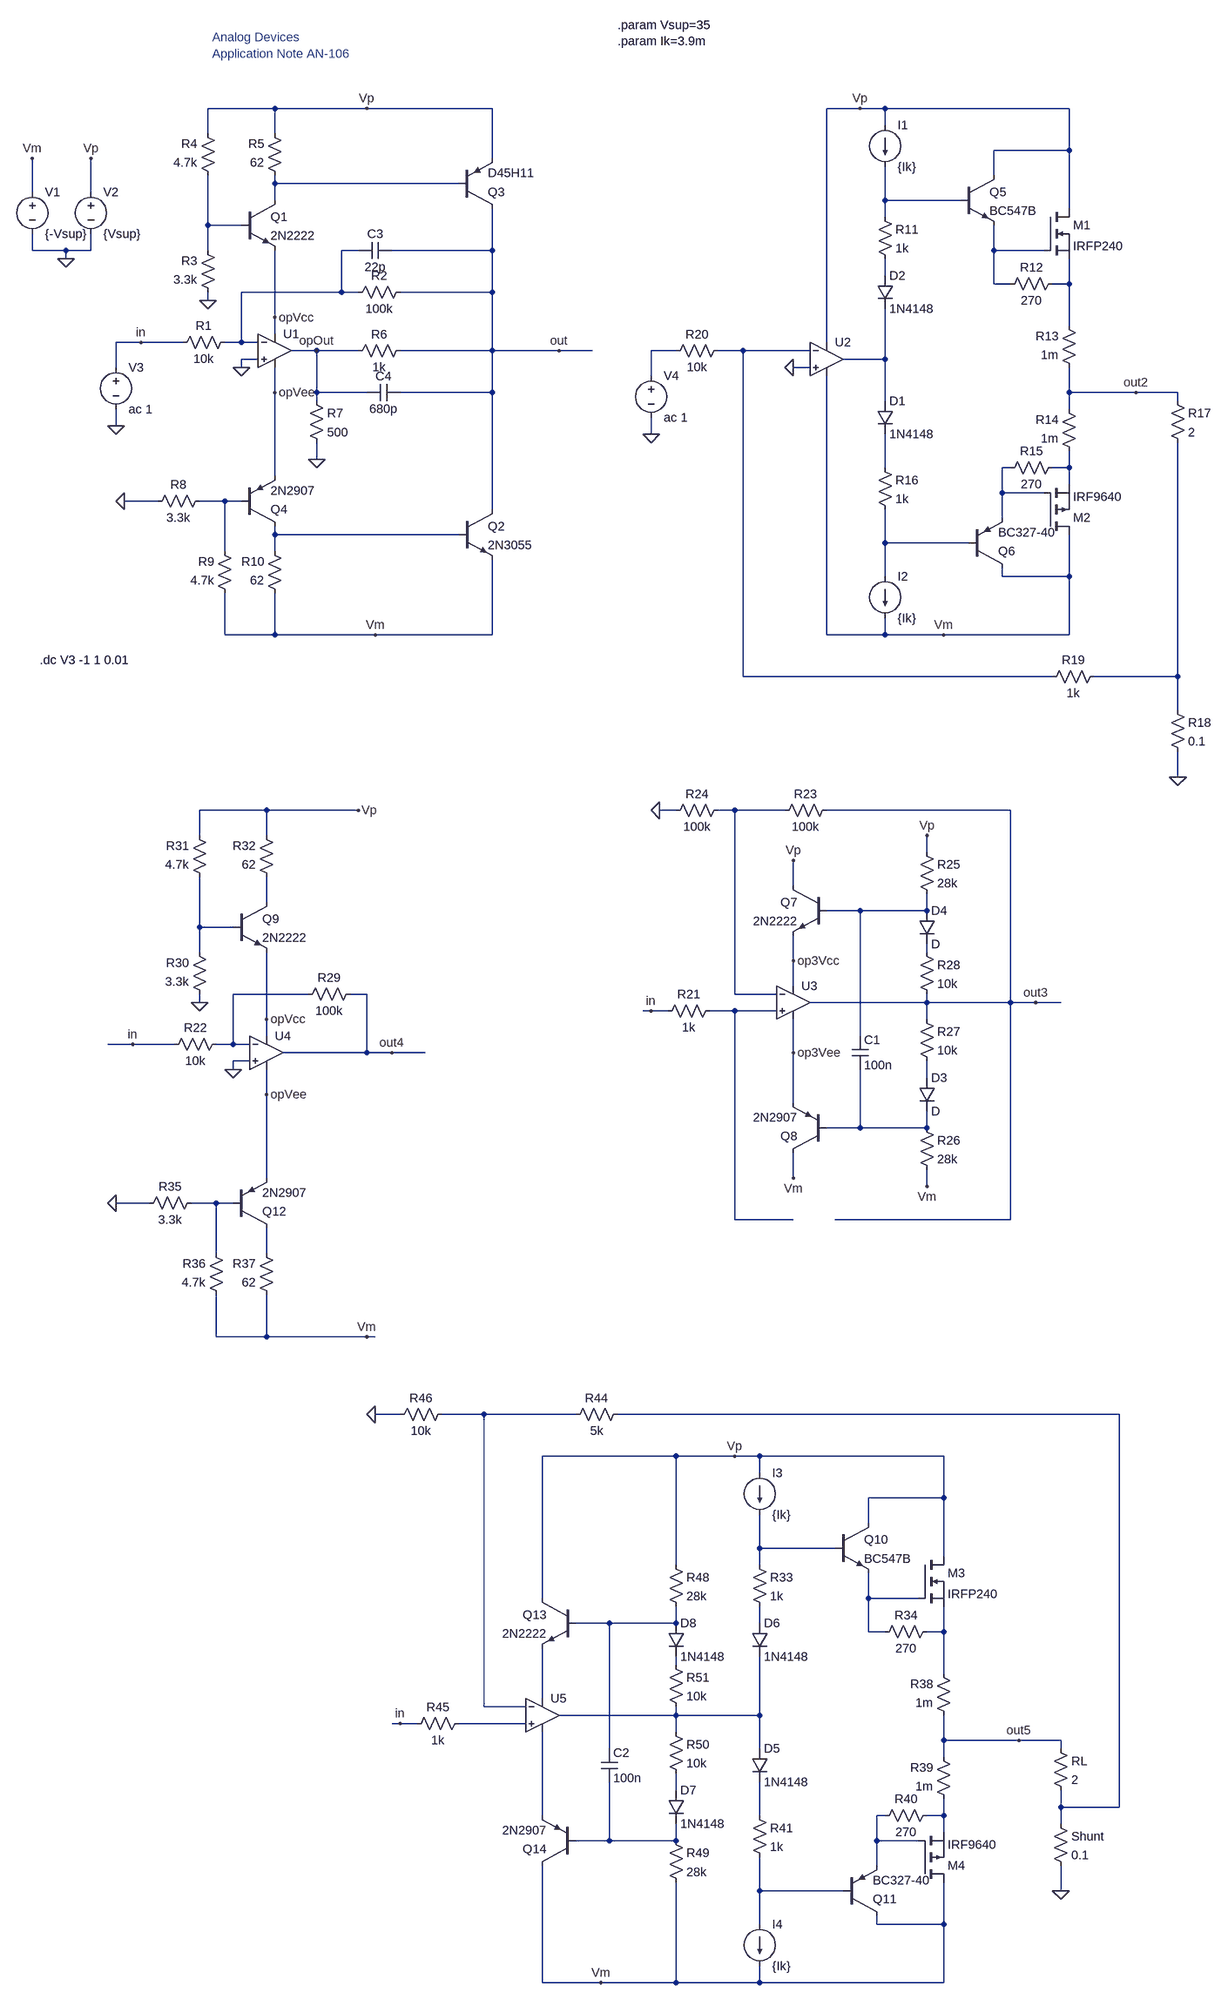
[diagram p0: schematic OpAmp_bootstrap_biased.asc]
OpAmp_bootstrap_biased.asc, the LTspice schematic file:
Version 4
SHEET 1 2744 3924
WIRE 128 -64 0 -64
WIRE 304 -64 128 -64
WIRE 544 -64 304 -64
WIRE 1248 -64 1184 -64
WIRE 1296 -64 1248 -64
WIRE 1648 -64 1296 -64
WIRE 1296 -32 1296 -64
WIRE 0 -16 0 -64
WIRE 128 -16 128 -64
WIRE 1648 16 1648 -64
WIRE 1648 16 1504 16
WIRE 544 32 544 -64
WIRE 1504 64 1504 16
WIRE 128 80 128 64
WIRE 480 80 128 80
WIRE -336 96 -336 32
WIRE -224 96 -224 32
WIRE 128 112 128 80
WIRE 1296 112 1296 48
WIRE 1440 112 1296 112
WIRE 1648 128 1648 16
WIRE 1296 144 1296 112
WIRE 0 160 0 64
WIRE 64 160 0 160
WIRE -336 208 -336 176
WIRE -272 208 -336 208
WIRE -224 208 -224 176
WIRE -224 208 -272 208
WIRE 0 208 0 160
WIRE 288 208 256 208
WIRE 544 208 544 128
WIRE 544 208 352 208
WIRE 1504 208 1504 160
WIRE 1600 208 1504 208
WIRE -272 224 -272 208
WIRE 1296 256 1296 224
WIRE 1504 272 1504 208
WIRE 1536 272 1504 272
WIRE 1648 272 1648 224
WIRE 1648 272 1616 272
WIRE 256 288 256 208
WIRE 256 288 64 288
WIRE 288 288 256 288
WIRE 544 288 544 208
WIRE 544 288 368 288
WIRE 0 304 0 288
WIRE 128 336 128 208
WIRE 1648 352 1648 272
WIRE 128 368 128 336
WIRE -128 384 -176 384
WIRE -48 384 -128 384
WIRE 64 384 64 288
WIRE 64 384 32 384
WIRE 96 384 64 384
WIRE 1184 384 1184 -64
WIRE 208 400 160 400
WIRE 288 400 208 400
WIRE 544 400 544 288
WIRE 544 400 368 400
WIRE 672 400 544 400
WIRE 736 400 672 400
WIRE 896 400 848 400
WIRE 1024 400 976 400
WIRE 1152 400 1024 400
WIRE 96 416 64 416
WIRE 1296 416 1296 320
WIRE 1296 416 1216 416
WIRE -176 432 -176 384
WIRE 64 432 64 416
WIRE 1152 432 1120 432
WIRE 848 448 848 400
WIRE 128 480 128 432
WIRE 208 480 208 400
WIRE 304 480 208 480
WIRE 544 480 544 400
WIRE 544 480 368 480
WIRE 1648 480 1648 432
WIRE 1776 480 1648 480
WIRE 1856 480 1776 480
WIRE 208 496 208 480
WIRE 1296 496 1296 416
WIRE 1856 496 1856 480
WIRE 1648 512 1648 480
WIRE -176 544 -176 512
WIRE 848 560 848 528
WIRE 208 608 208 576
WIRE 1296 624 1296 560
WIRE 1536 624 1520 624
WIRE 1648 624 1648 592
WIRE 1648 624 1616 624
WIRE 128 640 128 480
WIRE 1648 656 1648 624
WIRE 1520 672 1520 624
WIRE 1600 672 1520 672
WIRE -96 688 -160 688
WIRE 32 688 -16 688
WIRE 64 688 32 688
WIRE 544 704 544 480
WIRE 1520 720 1520 672
WIRE 128 752 128 736
WIRE 480 752 128 752
WIRE 1296 768 1296 704
WIRE 1456 768 1296 768
WIRE 32 784 32 688
WIRE 128 784 128 752
WIRE 1296 832 1296 768
WIRE 1520 832 1520 816
WIRE 1648 832 1648 752
WIRE 1648 832 1520 832
WIRE 32 944 32 864
WIRE 128 944 128 864
WIRE 128 944 32 944
WIRE 320 944 128 944
WIRE 544 944 544 800
WIRE 544 944 320 944
WIRE 1184 944 1184 448
WIRE 1296 944 1296 912
WIRE 1296 944 1184 944
WIRE 1408 944 1296 944
WIRE 1648 944 1648 832
WIRE 1648 944 1408 944
WIRE 1024 1024 1024 400
WIRE 1616 1024 1024 1024
WIRE 1856 1024 1856 576
WIRE 1856 1024 1696 1024
WIRE 1856 1088 1856 1024
WIRE 1856 1216 1856 1168
WIRE 112 1280 -16 1280
WIRE 288 1280 112 1280
WIRE 896 1280 864 1280
WIRE 1008 1280 976 1280
WIRE 1104 1280 1008 1280
WIRE 1536 1280 1184 1280
WIRE -16 1328 -16 1280
WIRE 112 1328 112 1280
WIRE 1376 1360 1376 1328
WIRE 1120 1424 1120 1376
WIRE 112 1456 112 1408
WIRE 1248 1472 1184 1472
WIRE 1376 1472 1376 1440
WIRE 1376 1472 1248 1472
WIRE -16 1504 -16 1408
WIRE 48 1504 -16 1504
WIRE -16 1552 -16 1504
WIRE 1376 1552 1376 1536
WIRE 1120 1568 1120 1520
WIRE 1120 1616 1120 1568
WIRE 192 1632 48 1632
WIRE 304 1632 272 1632
WIRE 1008 1632 1008 1280
WIRE 1088 1632 1008 1632
WIRE -16 1648 -16 1632
WIRE 1376 1648 1376 1632
WIRE 1376 1648 1152 1648
WIRE 1536 1648 1536 1280
WIRE 1536 1648 1376 1648
WIRE 1584 1648 1536 1648
WIRE 1632 1648 1584 1648
WIRE 848 1664 832 1664
WIRE 880 1664 848 1664
WIRE 1008 1664 960 1664
WIRE 1088 1664 1008 1664
WIRE 112 1680 112 1552
WIRE 1376 1680 1376 1648
WIRE 112 1712 112 1680
WIRE 1248 1712 1248 1472
WIRE -144 1728 -192 1728
WIRE -64 1728 -144 1728
WIRE 48 1728 48 1632
WIRE 48 1728 16 1728
WIRE 80 1728 48 1728
WIRE 304 1744 304 1632
WIRE 304 1744 144 1744
WIRE 352 1744 304 1744
WIRE 416 1744 352 1744
WIRE 1120 1744 1120 1680
WIRE 80 1760 48 1760
WIRE 48 1776 48 1760
WIRE 1376 1792 1376 1760
WIRE 112 1824 112 1776
WIRE 1120 1840 1120 1744
WIRE 1248 1888 1248 1776
WIRE 1248 1888 1184 1888
WIRE 1376 1888 1376 1856
WIRE 1376 1888 1248 1888
WIRE 112 1984 112 1824
WIRE 1120 1984 1120 1936
WIRE 1376 2000 1376 1968
WIRE -112 2032 -176 2032
WIRE 16 2032 -32 2032
WIRE 48 2032 16 2032
WIRE 1008 2064 1008 1664
WIRE 1120 2064 1008 2064
WIRE 1536 2064 1536 1648
WIRE 1536 2064 1200 2064
WIRE 16 2128 16 2032
WIRE 112 2128 112 2080
WIRE 16 2288 16 2208
WIRE 112 2288 112 2208
WIRE 112 2288 16 2288
WIRE 304 2288 112 2288
WIRE 320 2288 304 2288
WIRE 368 2480 320 2480
WIRE 528 2480 448 2480
WIRE 704 2480 528 2480
WIRE 1744 2480 784 2480
WIRE 896 2560 640 2560
WIRE 1008 2560 896 2560
WIRE 1056 2560 1008 2560
WIRE 1408 2560 1056 2560
WIRE 1056 2592 1056 2560
WIRE 1408 2640 1408 2560
WIRE 1408 2640 1264 2640
WIRE 1264 2688 1264 2640
WIRE 1056 2736 1056 2672
WIRE 1200 2736 1056 2736
WIRE 1408 2752 1408 2640
WIRE 896 2768 896 2560
WIRE 1056 2768 1056 2736
WIRE 640 2832 640 2560
WIRE 1264 2832 1264 2784
WIRE 1360 2832 1264 2832
WIRE 768 2880 704 2880
WIRE 896 2880 896 2848
WIRE 896 2880 768 2880
WIRE 1056 2880 1056 2848
WIRE 1264 2896 1264 2832
WIRE 1296 2896 1264 2896
WIRE 1408 2896 1408 2848
WIRE 1408 2896 1376 2896
WIRE 896 2960 896 2944
WIRE 1408 2976 1408 2896
WIRE 640 3024 640 2928
WIRE 528 3040 528 2480
WIRE 608 3040 528 3040
WIRE 896 3056 896 3040
WIRE 896 3056 672 3056
WIRE 1056 3056 1056 2944
WIRE 1056 3056 896 3056
WIRE 368 3072 352 3072
WIRE 400 3072 368 3072
WIRE 608 3072 480 3072
WIRE 896 3088 896 3056
WIRE 1408 3104 1408 3056
WIRE 1552 3104 1408 3104
WIRE 1632 3104 1552 3104
WIRE 768 3120 768 2880
WIRE 1056 3120 1056 3056
WIRE 1632 3120 1632 3104
WIRE 1408 3136 1408 3104
WIRE 896 3200 896 3168
WIRE 1632 3232 1632 3200
WIRE 1744 3232 1744 2480
WIRE 1744 3232 1632 3232
WIRE 640 3248 640 3088
WIRE 1056 3248 1056 3184
WIRE 1296 3248 1280 3248
WIRE 1408 3248 1408 3216
WIRE 1408 3248 1376 3248
WIRE 1632 3264 1632 3232
WIRE 1408 3280 1408 3248
WIRE 768 3296 768 3184
WIRE 768 3296 704 3296
WIRE 896 3296 896 3264
WIRE 896 3296 768 3296
WIRE 1280 3296 1280 3248
WIRE 1360 3296 1280 3296
WIRE 1280 3344 1280 3296
WIRE 1056 3392 1056 3328
WIRE 1216 3392 1056 3392
WIRE 1632 3392 1632 3344
WIRE 1056 3456 1056 3392
WIRE 1280 3456 1280 3440
WIRE 1408 3456 1408 3376
WIRE 1408 3456 1280 3456
WIRE 640 3568 640 3344
WIRE 752 3568 640 3568
WIRE 896 3568 896 3376
WIRE 896 3568 752 3568
WIRE 1056 3568 1056 3536
WIRE 1056 3568 896 3568
WIRE 1408 3568 1408 3456
WIRE 1408 3568 1056 3568
FLAG -272 224 0
FLAG -336 32 Vm
FLAG -224 32 Vp
FLAG -160 688 0
FLAG 0 304 0
FLAG 64 432 0
FLAG 208 608 0
FLAG -176 544 0
FLAG 320 944 Vm
FLAG 304 -64 Vp
FLAG 672 400 out
FLAG -128 384 in
FLAG 128 336 opVcc
FLAG 128 480 opVee
FLAG 208 400 opOut
FLAG 1856 1216 0
FLAG 848 560 0
FLAG 1776 480 out2
FLAG 1248 -64 Vp
FLAG 1408 944 Vm
FLAG 1120 432 0
FLAG 1120 1984 Vm
FLAG 1120 1376 Vp
FLAG 848 1664 in
FLAG 864 1280 0
FLAG 1376 2000 Vm
FLAG 1376 1328 Vp
FLAG 1584 1648 out3
FLAG -176 2032 0
FLAG -16 1648 0
FLAG 48 1776 0
FLAG 304 2288 Vm
FLAG 288 1280 Vp
FLAG -144 1728 in
FLAG 112 1680 opVcc
FLAG 112 1824 opVee
FLAG 352 1744 out4
FLAG 1120 1568 op3Vcc
FLAG 1120 1744 op3Vee
FLAG 1632 3392 0
FLAG 1552 3104 out5
FLAG 1008 2560 Vp
FLAG 752 3568 Vm
FLAG 368 3072 in
FLAG 320 2480 0
SYMBOL Opamps\\UniversalOpamp2 128 400 R0
SYMATTR InstName U1
SYMBOL voltage -336 80 R0
WINDOW 123 0 0 Left 2
WINDOW 39 0 0 Left 2
SYMATTR InstName V1
SYMATTR Value {-Vsup}
SYMBOL voltage -224 80 R0
WINDOW 123 0 0 Left 2
WINDOW 39 0 0 Left 2
SYMATTR InstName V2
SYMATTR Value {Vsup}
SYMBOL npn 64 112 R0
SYMATTR InstName Q1
SYMATTR Value 2N2222
SYMBOL npn 480 704 R0
SYMATTR InstName Q2
SYMATTR Value 2N3055
SYMBOL pnp 480 128 M180
SYMATTR InstName Q3
SYMATTR Value D45H11
SYMBOL pnp 64 736 M180
SYMATTR InstName Q4
SYMATTR Value 2N2907
SYMBOL res 48 368 R90
WINDOW 0 0 56 VBottom 2
WINDOW 3 32 56 VTop 2
SYMATTR InstName R1
SYMATTR Value 10k
SYMBOL res 384 272 R90
WINDOW 0 0 56 VBottom 2
WINDOW 3 32 56 VTop 2
SYMATTR InstName R2
SYMATTR Value 100k
SYMBOL res 16 304 R180
WINDOW 0 36 76 Left 2
WINDOW 3 36 40 Left 2
SYMATTR InstName R3
SYMATTR Value 3.3k
SYMBOL res 16 80 R180
WINDOW 0 36 76 Left 2
WINDOW 3 36 40 Left 2
SYMATTR InstName R4
SYMATTR Value 4.7k
SYMBOL res 144 80 R180
WINDOW 0 36 76 Left 2
WINDOW 3 36 40 Left 2
SYMATTR InstName R5
SYMATTR Value 62
SYMBOL res 272 416 R270
WINDOW 0 32 56 VTop 2
WINDOW 3 0 56 VBottom 2
SYMATTR InstName R6
SYMATTR Value 1k
SYMBOL res 192 480 R0
SYMATTR InstName R7
SYMATTR Value 500
SYMBOL res 0 672 R90
WINDOW 0 0 56 VBottom 2
WINDOW 3 32 56 VTop 2
SYMATTR InstName R8
SYMATTR Value 3.3k
SYMBOL res 48 880 R180
WINDOW 0 36 76 Left 2
WINDOW 3 36 40 Left 2
SYMATTR InstName R9
SYMATTR Value 4.7k
SYMBOL res 144 880 R180
WINDOW 0 36 76 Left 2
WINDOW 3 36 40 Left 2
SYMATTR InstName R10
SYMATTR Value 62
SYMBOL cap 288 224 R270
WINDOW 0 32 32 VTop 2
WINDOW 3 0 32 VBottom 2
SYMATTR InstName C3
SYMATTR Value 22p
SYMBOL cap 368 464 R90
WINDOW 0 0 32 VBottom 2
WINDOW 3 32 32 VTop 2
SYMATTR InstName C4
SYMATTR Value 680p
SYMBOL voltage -176 416 R0
WINDOW 123 0 0 Left 2
WINDOW 39 0 0 Left 2
SYMATTR InstName V3
SYMATTR Value ac 1
SYMBOL current 1296 -32 R0
WINDOW 123 0 0 Left 2
WINDOW 39 0 0 Left 2
SYMATTR InstName I1
SYMATTR Value {Ik}
SYMBOL current 1296 832 R0
WINDOW 123 0 0 Left 2
WINDOW 39 0 0 Left 2
SYMATTR InstName I2
SYMATTR Value {Ik}
SYMBOL res 1280 128 R0
SYMATTR InstName R11
SYMATTR Value 1k
SYMBOL npn 1440 64 R0
SYMATTR InstName Q5
SYMATTR Value BC547B
SYMBOL nmos 1600 128 R0
SYMATTR InstName M1
SYMATTR Value IRFP240
SYMBOL res 1632 256 R90
WINDOW 0 0 56 VBottom 2
WINDOW 3 32 56 VTop 2
SYMATTR InstName R12
SYMATTR Value 270
SYMBOL res 1664 448 R180
WINDOW 0 36 76 Left 2
WINDOW 3 36 40 Left 2
SYMATTR InstName R13
SYMATTR Value 1m
SYMBOL res 1664 608 R180
WINDOW 0 36 76 Left 2
WINDOW 3 36 40 Left 2
SYMATTR InstName R14
SYMATTR Value 1m
SYMBOL pmos 1600 752 M180
SYMATTR InstName M2
SYMATTR Value IRF9640
SYMBOL pnp 1456 816 M180
SYMATTR InstName Q6
SYMATTR Value BC327-40
SYMBOL res 1520 640 R270
WINDOW 0 32 56 VTop 2
WINDOW 3 0 56 VBottom 2
SYMATTR InstName R15
SYMATTR Value 270
SYMBOL res 1280 608 R0
SYMATTR InstName R16
SYMATTR Value 1k
SYMBOL diode 1280 496 R0
SYMATTR InstName D1
SYMATTR Value 1N4148
SYMBOL diode 1280 256 R0
SYMATTR InstName D2
SYMATTR Value 1N4148
SYMBOL Opamps\\UniversalOpamp2 1184 416 R0
SYMATTR InstName U2
SYMBOL res 1840 480 R0
SYMATTR InstName R17
SYMATTR Value 2
SYMBOL res 1840 1072 R0
SYMATTR InstName R18
SYMATTR Value 0.1
SYMBOL res 1712 1008 R90
WINDOW 0 0 56 VBottom 2
WINDOW 3 32 56 VTop 2
SYMATTR InstName R19
SYMATTR Value 1k
SYMBOL res 992 384 R90
WINDOW 0 0 56 VBottom 2
WINDOW 3 32 56 VTop 2
SYMATTR InstName R20
SYMATTR Value 10k
SYMBOL voltage 848 432 R0
WINDOW 123 0 0 Left 2
WINDOW 39 0 0 Left 2
SYMATTR InstName V4
SYMATTR Value ac 1
SYMBOL Opamps\\UniversalOpamp2 1120 1648 R0
SYMATTR InstName U3
SYMBOL res 976 1648 R90
WINDOW 0 0 56 VBottom 2
WINDOW 3 32 56 VTop 2
SYMATTR InstName R21
SYMATTR Value 1k
SYMBOL npn 1184 1424 M0
SYMATTR InstName Q7
SYMATTR Value 2N2222
SYMBOL pnp 1184 1936 R180
SYMATTR InstName Q8
SYMATTR Value 2N2907
SYMBOL res 1088 1296 R270
WINDOW 0 32 56 VTop 2
WINDOW 3 0 56 VBottom 2
SYMATTR InstName R23
SYMATTR Value 100k
SYMBOL res 880 1296 R270
WINDOW 0 32 56 VTop 2
WINDOW 3 0 56 VBottom 2
SYMATTR InstName R24
SYMATTR Value 100k
SYMBOL res 1360 1344 R0
SYMATTR InstName R25
SYMATTR Value 28k
SYMBOL res 1360 1872 R0
SYMATTR InstName R26
SYMATTR Value 28k
SYMBOL res 1360 1664 R0
SYMATTR InstName R27
SYMATTR Value 10k
SYMBOL res 1360 1536 R0
SYMATTR InstName R28
SYMATTR Value 10k
SYMBOL diode 1360 1792 R0
SYMATTR InstName D3
SYMBOL diode 1360 1472 R0
SYMATTR InstName D4
SYMBOL Opamps\\UniversalOpamp2 112 1744 R0
SYMATTR InstName U4
SYMBOL npn 48 1456 R0
SYMATTR InstName Q9
SYMATTR Value 2N2222
SYMBOL pnp 48 2080 M180
SYMATTR InstName Q12
SYMATTR Value 2N2907
SYMBOL res 32 1712 R90
WINDOW 0 0 56 VBottom 2
WINDOW 3 32 56 VTop 2
SYMATTR InstName R22
SYMATTR Value 10k
SYMBOL res 288 1616 R90
WINDOW 0 0 56 VBottom 2
WINDOW 3 32 56 VTop 2
SYMATTR InstName R29
SYMATTR Value 100k
SYMBOL res 0 1648 R180
WINDOW 0 36 76 Left 2
WINDOW 3 36 40 Left 2
SYMATTR InstName R30
SYMATTR Value 3.3k
SYMBOL res 0 1424 R180
WINDOW 0 36 76 Left 2
WINDOW 3 36 40 Left 2
SYMATTR InstName R31
SYMATTR Value 4.7k
SYMBOL res 128 1424 R180
WINDOW 0 36 76 Left 2
WINDOW 3 36 40 Left 2
SYMATTR InstName R32
SYMATTR Value 62
SYMBOL res -16 2016 R90
WINDOW 0 0 56 VBottom 2
WINDOW 3 32 56 VTop 2
SYMATTR InstName R35
SYMATTR Value 3.3k
SYMBOL res 32 2224 R180
WINDOW 0 36 76 Left 2
WINDOW 3 36 40 Left 2
SYMATTR InstName R36
SYMATTR Value 4.7k
SYMBOL res 128 2224 R180
WINDOW 0 36 76 Left 2
WINDOW 3 36 40 Left 2
SYMATTR InstName R37
SYMATTR Value 62
SYMBOL cap 1232 1712 R0
SYMATTR InstName C1
SYMATTR Value 100n
SYMBOL current 1056 2592 R0
WINDOW 123 0 0 Left 2
WINDOW 39 0 0 Left 2
SYMATTR InstName I3
SYMATTR Value {Ik}
SYMBOL current 1056 3456 R0
WINDOW 123 0 0 Left 2
WINDOW 39 0 0 Left 2
SYMATTR InstName I4
SYMATTR Value {Ik}
SYMBOL res 1040 2752 R0
SYMATTR InstName R33
SYMATTR Value 1k
SYMBOL npn 1200 2688 R0
SYMATTR InstName Q10
SYMATTR Value BC547B
SYMBOL nmos 1360 2752 R0
SYMATTR InstName M3
SYMATTR Value IRFP240
SYMBOL res 1392 2880 R90
WINDOW 0 0 56 VBottom 2
WINDOW 3 32 56 VTop 2
SYMATTR InstName R34
SYMATTR Value 270
SYMBOL res 1424 3072 R180
WINDOW 0 36 76 Left 2
WINDOW 3 36 40 Left 2
SYMATTR InstName R38
SYMATTR Value 1m
SYMBOL res 1424 3232 R180
WINDOW 0 36 76 Left 2
WINDOW 3 36 40 Left 2
SYMATTR InstName R39
SYMATTR Value 1m
SYMBOL pmos 1360 3376 M180
SYMATTR InstName M4
SYMATTR Value IRF9640
SYMBOL pnp 1216 3440 M180
SYMATTR InstName Q11
SYMATTR Value BC327-40
SYMBOL res 1280 3264 R270
WINDOW 0 32 56 VTop 2
WINDOW 3 0 56 VBottom 2
SYMATTR InstName R40
SYMATTR Value 270
SYMBOL res 1040 3232 R0
SYMATTR InstName R41
SYMATTR Value 1k
SYMBOL diode 1040 3120 R0
SYMATTR InstName D5
SYMATTR Value 1N4148
SYMBOL diode 1040 2880 R0
SYMATTR InstName D6
SYMATTR Value 1N4148
SYMBOL res 1616 3104 R0
SYMATTR InstName RL
SYMATTR Value 2
SYMBOL res 1616 3248 R0
SYMATTR InstName Shunt
SYMATTR Value 0.1
SYMBOL res 800 2464 R90
WINDOW 0 0 56 VBottom 2
WINDOW 3 32 56 VTop 2
SYMATTR InstName R44
SYMATTR Value 5k
SYMBOL Opamps\\UniversalOpamp2 640 3056 R0
SYMATTR InstName U5
SYMBOL res 496 3056 R90
WINDOW 0 0 56 VBottom 2
WINDOW 3 32 56 VTop 2
SYMATTR InstName R45
SYMATTR Value 1k
SYMBOL npn 704 2832 M0
SYMATTR InstName Q13
SYMATTR Value 2N2222
SYMBOL pnp 704 3344 R180
SYMATTR InstName Q14
SYMATTR Value 2N2907
SYMBOL res 880 2752 R0
SYMATTR InstName R48
SYMATTR Value 28k
SYMBOL res 880 3280 R0
SYMATTR InstName R49
SYMATTR Value 28k
SYMBOL res 880 3072 R0
SYMATTR InstName R50
SYMATTR Value 10k
SYMBOL res 880 2944 R0
SYMATTR InstName R51
SYMATTR Value 10k
SYMBOL diode 880 3200 R0
SYMATTR InstName D7
SYMATTR Value 1N4148
SYMBOL diode 880 2880 R0
SYMATTR InstName D8
SYMATTR Value 1N4148
SYMBOL cap 752 3120 R0
SYMATTR InstName C2
SYMATTR Value 100n
SYMBOL res 464 2464 R90
WINDOW 0 0 56 VBottom 2
WINDOW 3 32 56 VTop 2
SYMATTR InstName R46
SYMATTR Value 10k
TEXT -322 992 Left 2 !.dc V3 -1 1 0.01
TEXT 784 -224 Left 2 !.param Vsup=35\n.param Ik=3.9m
TEXT 8 -200 Left 2 ;Analog Devices\nApplication Note AN-106

The netlist it stands for:
* OpAmp_bootstrap_biased.asc
XU1 0 N004 opVcc opVee opOut level.2 Avol=1Meg GBW=10Meg Slew=10Meg ilimit=25m rail=0 Vos=0 phimargin=45 en=0 enk=0 in=0 ink=0 Rin=500Meg  ; pins IN+ IN- V+ V- OUT
V1 Vm 0 {-Vsup}
V2 Vp 0 {Vsup}
Q1 N001 N003 opVcc 0 2N2222
Q2 out N015 Vm 0 2N3055
Q3 out N001 Vp 0 D45H11
Q4 N015 N014 opVee 0 2N2907
R1 N004 in 10k
R2 out N004 100k
R3 0 N003 3.3k
R4 N003 Vp 4.7k
R5 N001 Vp 62
R6 opOut out 1k
R7 opOut 0 500
R8 N014 0 3.3k
R9 Vm N014 4.7k
R10 Vm N015 62
C3 N004 out 22p
C4 out opOut 680p
V3 in 0 ac 1
I1 Vp N002 {Ik}
I2 N016 Vm {Ik}
R11 N002 N006 1k
Q5 Vp N002 N005 0 BC547B
M1 Vp N005 N007 N007 IRFP240
R12 N007 N005 270
R13 out2 N007 1m
R14 N013 out2 1m
M2 Vm N012 N013 N013 IRF9640
Q6 Vm N016 N012 0 BC327-40
R15 N012 N013 270
R16 N011 N016 1k
D1 N010 N011 1N4148
D2 N006 N010 1N4148
XU2 0 N009 Vp Vm N010 level.2 Avol=1Meg GBW=10Meg Slew=10Meg ilimit=25m rail=0 Vos=0 phimargin=45 en=0 enk=0 in=0 ink=0 Rin=500Meg  ; pins IN+ IN- V+ V- OUT
R17 out2 N017 2
R18 N017 0 0.1
R19 N017 N009 1k
R20 N009 N008 10k
V4 N008 0 ac 1
XU3 N024 N018 op3Vcc op3Vee out3 level.2 Avol=1Meg GBW=10Meg Slew=10Meg ilimit=25m rail=0 Vos=0 phimargin=45 en=0 enk=0 in=0 ink=0 Rin=500Meg  ; pins IN+ IN- V+ V- OUT
R21 N024 in 1k
Q7 Vp N020 op3Vcc 0 2N2222
Q8 Vm N026 op3Vee 0 2N2907
R23 N018 out3 100k
R24 0 N018 100k
R25 Vp N020 28k
R26 N026 Vm 28k
R27 out3 N025 10k
R28 N022 out3 10k
D3 N025 N026 D
D4 N020 N022 D
XU4 0 N023 opVcc opVee out4 level.2 Avol=1Meg GBW=10Meg Slew=10Meg ilimit=25m rail=0 Vos=0 phimargin=45 en=0 enk=0 in=0 ink=0 Rin=500Meg  ; pins IN+ IN- V+ V- OUT
Q9 N019 N021 opVcc 0 2N2222
Q12 N028 N027 opVee 0 2N2907
R22 N023 in 10k
R29 out4 N023 100k
R30 0 N021 3.3k
R31 N021 Vp 4.7k
R32 N019 Vp 62
R35 N027 0 3.3k
R36 Vm N027 4.7k
R37 Vm N028 62
C1 N020 N026 100n
I3 Vp N031 {Ik}
I4 N046 Vm {Ik}
R33 N031 N034 1k
Q10 Vp N031 N032 0 BC547B
M3 Vp N032 N035 N035 IRFP240
R34 N035 N032 270
R38 out5 N035 1m
R39 N044 out5 1m
M4 Vm N043 N044 N044 IRF9640
Q11 Vm N046 N043 0 BC327-40
R40 N043 N044 270
R41 N042 N046 1k
D5 N038 N042 1N4148
D6 N034 N038 1N4148
RL out5 N030 2
R§Shunt N030 0 0.1
R44 N030 N029 5k
XU5 N039 N029 N037 N041 N038 level.2 Avol=1Meg GBW=10Meg Slew=10Meg ilimit=25m rail=0 Vos=0 phimargin=45 en=0 enk=0 in=0 ink=0 Rin=500Meg  ; pins IN+ IN- V+ V- OUT
R45 N039 in 1k
Q13 Vp N033 N037 0 2N2222
Q14 Vm N045 N041 0 2N2907
R48 Vp N033 28k
R49 N045 Vm 28k
R50 N038 N040 10k
R51 N036 N038 10k
D7 N040 N045 1N4148
D8 N033 N036 1N4148
C2 N033 N045 100n
R46 N029 0 10k
.model D D
.lib standard.dio
.model NPN NPN
.model PNP PNP
.lib standard.bjt
.model NMOS NMOS
.model PMOS PMOS
.lib standard.mos
.dc V3 -1 1 0.01
.param Vsup=35
.param Ik=3.9m
* Analog Devices
* Application Note AN-106
.lib UniversalOpamps2.sub
.backanno
.end